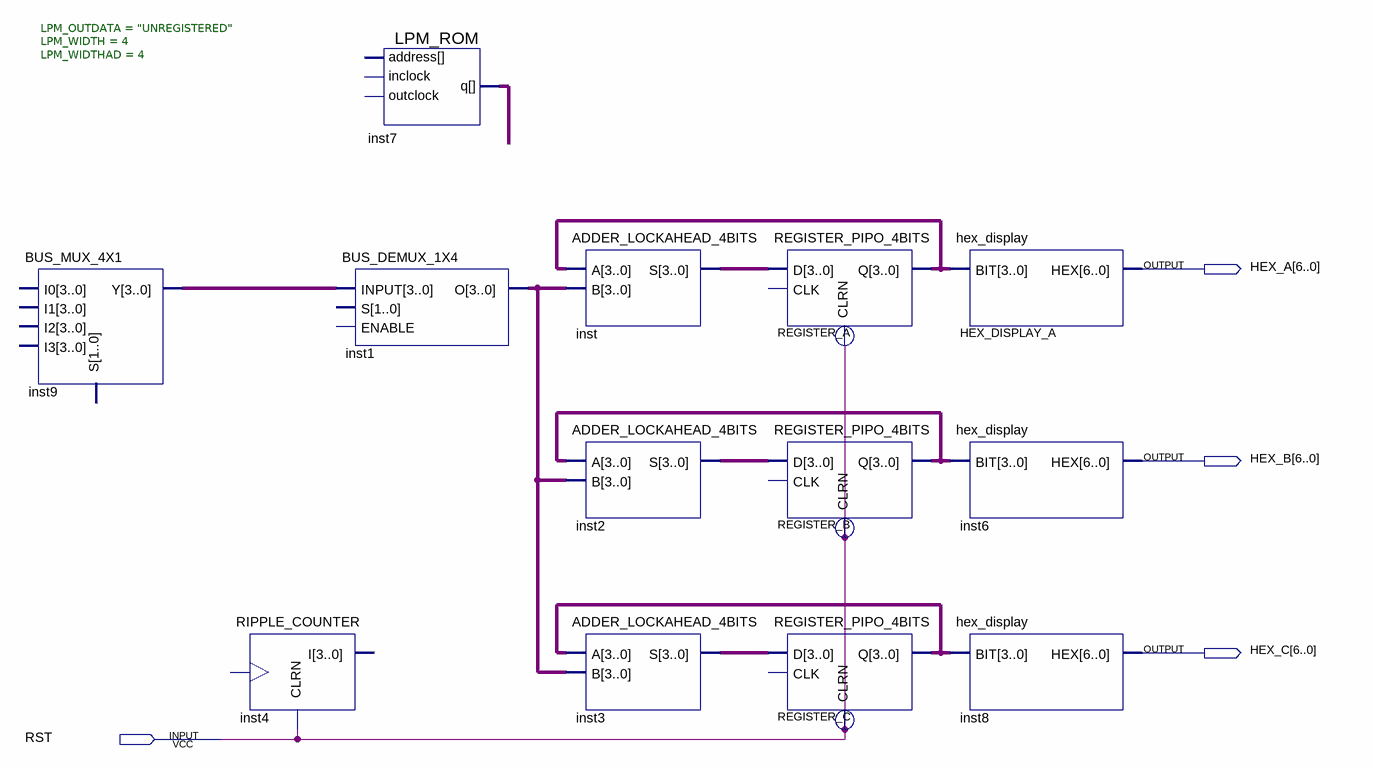
[diagram p0: schematic sheet]
// Quartus schematic Micro_CPU.bdf as structural Verilog: 13 symbols, 4 pins
module Micro_CPU (
  input  RST,
  output [6:0] HEX_A,
  output [6:0] HEX_B,
  output [6:0] HEX_C
);

  wire [3:0] inst1_o, inst2_s, inst3_s, inst7_q, inst9_y, inst_s, REGISTER_A_q, REGISTER_B_q, REGISTER_C_q;

  BUS_MUX_4X1 inst9 (.Y(inst9_y));  // open: I0, I1, I2, I3, S
  RIPPLE_COUNTER inst4 (.CLRN(RST));  // open: CLK, I
  LPM_ROM #(.LPM_OUTDATA("UNREGISTERED"), .LPM_WIDTH(4), .LPM_WIDTHAD(4)) inst7 (.q(inst7_q));  // open: address, inclock, outclock
  BUS_DEMUX_1X4 inst1 (.INPUT(inst9_y), .O(inst1_o));  // open: S, ENABLE
  ADDER_LOCKAHEAD_4BITS inst (.A(REGISTER_A_q), .B(inst1_o), .S(inst_s));
  ADDER_LOCKAHEAD_4BITS inst2 (.A(REGISTER_B_q), .B(inst1_o), .S(inst2_s));
  ADDER_LOCKAHEAD_4BITS inst3 (.A(REGISTER_C_q), .B(inst1_o), .S(inst3_s));
  REGISTER_PIPO_4BITS REGISTER_A (.D(inst_s), .CLRN(RST), .Q(REGISTER_A_q));  // open: CLK
  REGISTER_PIPO_4BITS REGISTER_B (.D(inst2_s), .CLRN(RST), .Q(REGISTER_B_q));  // open: CLK
  REGISTER_PIPO_4BITS REGISTER_C (.D(inst3_s), .CLRN(RST), .Q(REGISTER_C_q));  // open: CLK
  hex_display HEX_DISPLAY_A (.BIT(REGISTER_A_q), .HEX(HEX_A));
  hex_display inst6 (.BIT(REGISTER_B_q), .HEX(HEX_B));
  hex_display inst8 (.BIT(REGISTER_C_q), .HEX(HEX_C));
endmodule
